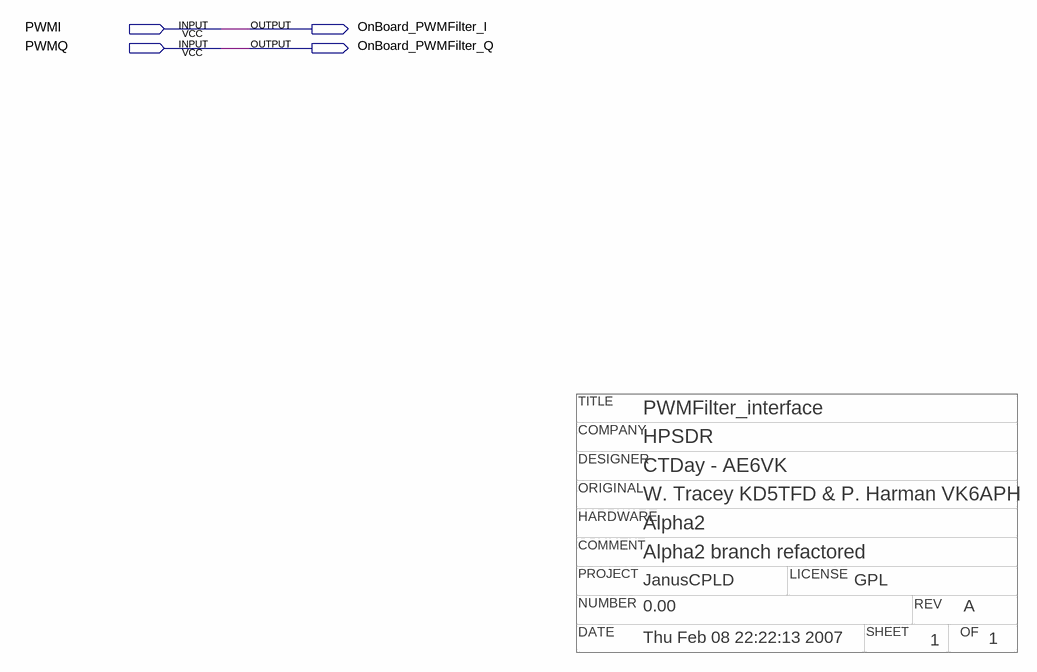
[diagram p0: schematic sheet]
// Quartus schematic PWMFilter_interface.bdf as structural Verilog: 0 symbols, 4 pins
// Title block: TITLE: PWMFilter_interface; COMPANY: HPSDR; DESIGNER: CTDay - AE6VK; NUMBER: 0.00; REV: A; DATE: Thu Feb 08 22:22:13 2007; SHEET: 1; OF: 1; ORIGINAL: W. Tracey KD5TFD & P. Harman VK6APH; HARDWARE: Alpha2; COMMENT: Alpha2 branch refactored; PROJECT: JanusCPLD; LICENSE: GPL
module PWMFilter_interface (
  input  PWMI,
  input  PWMQ,
  output OnBoard_PWMFilter_I,
  output OnBoard_PWMFilter_Q
);


  assign OnBoard_PWMFilter_I = PWMI;
  assign OnBoard_PWMFilter_Q = PWMQ;
endmodule
